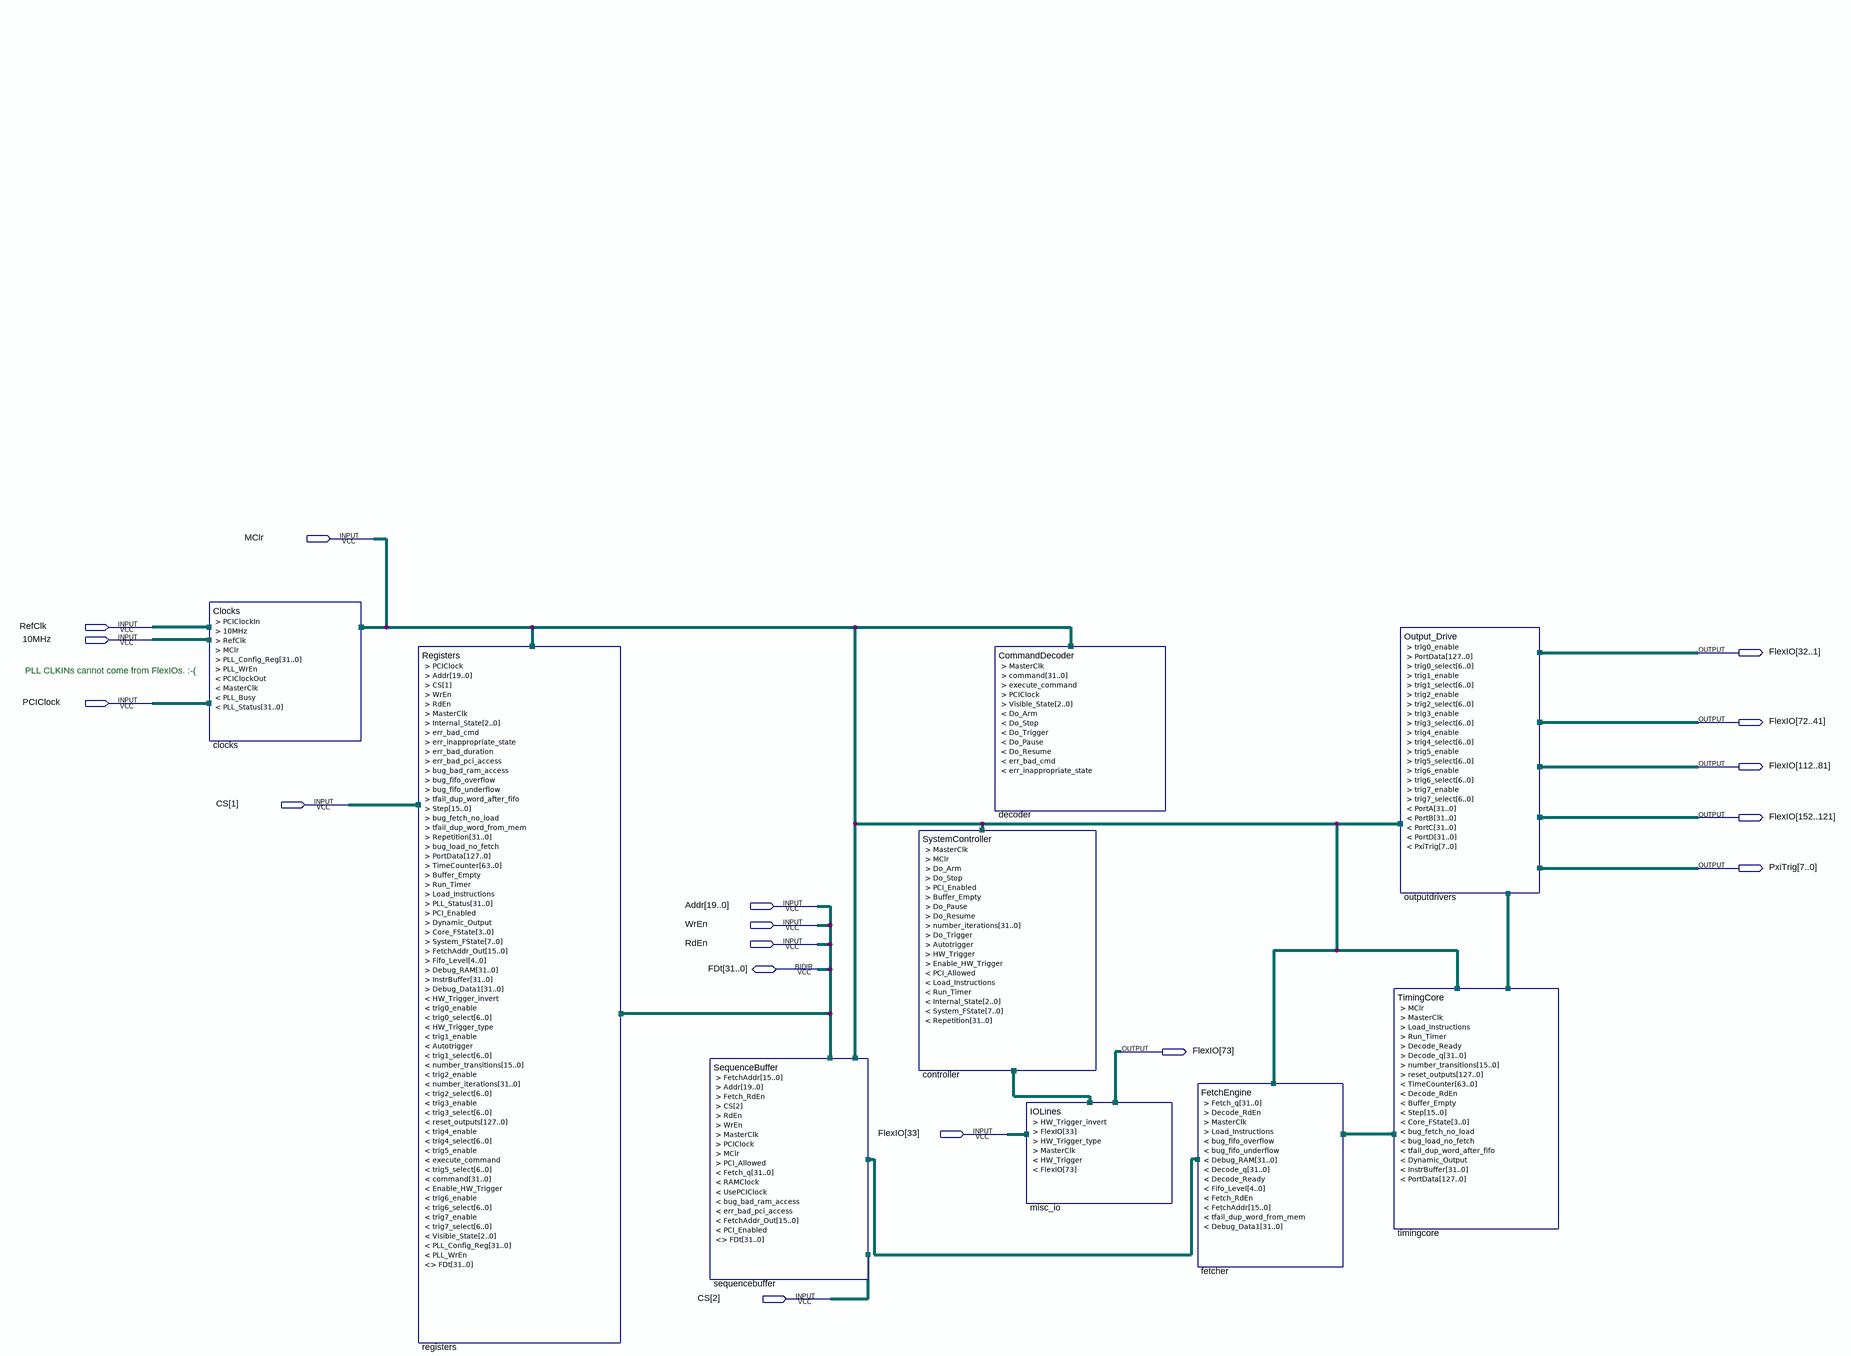
[diagram p0: schematic sheet]
// Quartus schematic TimingGenerator128b.bdf as structural Verilog: 9 symbols, 17 pins
module TimingGenerator128b (
  input  MClr,
  input  RefClk,
  input  \10MHz ,
  input  PCIClock,
  input  [2:1] CS,
  input  [19:0] Addr,
  input  WrEn,
  input  RdEn,
  inout  [152:1] FlexIO,
  inout  [31:0] FDt,
  output [7:0] PxiTrig
);

  wire Autotrigger, Buffer_Empty, bug_bad_ram_access, bug_fetch_no_load, bug_fifo_overflow,
       bug_fifo_underflow, bug_load_no_fetch, Decode_RdEn, Decode_Ready, Do_Arm, Do_Pause, Do_Resume,
       Do_Stop, Do_Trigger, Dynamic_Output, Enable_HW_Trigger, err_bad_pci_access, Fetch_RdEn,
       Load_Instructions, MasterClk, PCI_Allowed, PCI_Enabled, PCIClockBuf, Run_Timer,
       tfail_dup_word_after_fifo, tfail_dup_word_from_mem, trig0_enable, trig1_enable, trig2_enable,
       trig3_enable, trig4_enable, trig5_enable, trig6_enable, trig7_enable;
  wire [2:0] Internal_State;
  wire [3:0] Core_FState;
  wire [4:0] Fifo_Level;
  wire [6:0] trig0_select, trig1_select, trig2_select, trig3_select, trig4_select, trig5_select,
       trig6_select, trig7_select;
  wire [7:0] System_FState;
  wire [15:0] FetchAddr, FetchAddr_Out, number_transitions, Step;
  wire [31:0] Debug_Data1, Debug_RAM, Decode_q, Fetch_q, InstrBuffer, number_iterations, Repetition;
  wire [63:0] TimeCounter;
  wire [127:0] PortData, reset_outputs;

  Clocks clocks (
    .PCIClockIn(PCIClock), .\10MHz (\10MHz ), .RefClk(RefClk), .PCIClockOut(PCIClockBuf));  // open: MClr, PLL_Config_Reg, PLL_WrEn, MasterClk, PLL_Busy, PLL_Status
  Registers registers (
    .PCIClock(PCIClockBuf), .Addr(Addr), .CS(CS[1]), .WrEn(WrEn), .RdEn(RdEn), .MasterClk(MasterClk),
    .err_bad_pci_access(err_bad_pci_access), .bug_bad_ram_access(bug_bad_ram_access),
    .PCI_Enabled(PCI_Enabled), .FetchAddr_Out(FetchAddr_Out), .FDt(FDt));  // open: Internal_State, err_bad_cmd, err_inappropriate_state, err_bad_duration, bug_fifo_overflow, bug_fifo_underflow, tfail_dup_word_after_fifo, Step, bug_fetch_no_load, tfail_dup_word_from_mem, Repetition, bug_load_no_fetch, PortData, TimeCounter, Buffer_Empty, Run_Timer, Load_Instructions, PLL_Status, Dynamic_Output, Core_FState, System_FState, Fifo_Level, Debug_RAM, InstrBuffer, Debug_Data1, HW_Trigger_invert, trig0_enable, trig0_select, HW_Trigger_type, trig1_enable, Autotrigger, trig1_select, number_transitions, trig2_enable, number_iterations, trig2_select, trig3_enable, trig3_select, reset_outputs, trig4_enable, trig4_select, trig5_enable, execute_command, trig5_select, command, Enable_HW_Trigger, trig6_enable, trig6_select, trig7_enable, trig7_select, Visible_State, PLL_Config_Reg, PLL_WrEn
  SequenceBuffer sequencebuffer (
    .FetchAddr(FetchAddr), .Addr(Addr), .Fetch_RdEn(Fetch_RdEn), .CS(CS[2]), .RdEn(RdEn), .WrEn(WrEn),
    .MasterClk(MasterClk), .PCIClock(PCIClockBuf), .Fetch_q(Fetch_q),
    .bug_bad_ram_access(bug_bad_ram_access), .err_bad_pci_access(err_bad_pci_access),
    .FetchAddr_Out(FetchAddr_Out), .PCI_Enabled(PCI_Enabled), .FDt(FDt));  // open: MClr, PCI_Allowed, RAMClock, UsePCIClock
  SystemController controller (
    .MasterClk(MasterClk), .MClr(MClr), .Do_Arm(Do_Arm), .Do_Stop(Do_Stop), .PCI_Enabled(PCI_Enabled),
    .Buffer_Empty(Buffer_Empty), .Do_Pause(Do_Pause), .Do_Resume(Do_Resume),
    .number_iterations(number_iterations), .Do_Trigger(Do_Trigger), .Autotrigger(Autotrigger),
    .Enable_HW_Trigger(Enable_HW_Trigger), .PCI_Allowed(PCI_Allowed), .Load_Instructions(Load_Instructions),
    .Run_Timer(Run_Timer), .Internal_State(Internal_State), .System_FState(System_FState),
    .Repetition(Repetition));  // open: HW_Trigger
  CommandDecoder decoder (.PCIClock(PCIClockBuf));  // open: MasterClk, command, execute_command, Visible_State, Do_Arm, Do_Stop, Do_Trigger, Do_Pause, Do_Resume, err_bad_cmd, err_inappropriate_state
  IOLines misc_io (
    .FlexIO({FlexIO[73], FlexIO[33]}), .MasterClk(MasterClk));  // open: HW_Trigger_invert, HW_Trigger_type, HW_Trigger
  FetchEngine fetcher (
    .Fetch_q(Fetch_q), .Decode_RdEn(Decode_RdEn), .MasterClk(MasterClk),
    .Load_Instructions(Load_Instructions), .bug_fifo_overflow(bug_fifo_overflow),
    .bug_fifo_underflow(bug_fifo_underflow), .Debug_RAM(Debug_RAM), .Decode_q(Decode_q),
    .Decode_Ready(Decode_Ready), .Fifo_Level(Fifo_Level), .Fetch_RdEn(Fetch_RdEn), .FetchAddr(FetchAddr),
    .tfail_dup_word_from_mem(tfail_dup_word_from_mem), .Debug_Data1(Debug_Data1));
  Output_Drive outputdrivers (
    .trig0_enable(trig0_enable), .PortData(PortData), .trig0_select(trig0_select),
    .trig1_enable(trig1_enable), .trig1_select(trig1_select), .trig2_enable(trig2_enable),
    .trig2_select(trig2_select), .trig3_enable(trig3_enable), .trig3_select(trig3_select),
    .trig4_enable(trig4_enable), .trig4_select(trig4_select), .trig5_enable(trig5_enable),
    .trig5_select(trig5_select), .trig6_enable(trig6_enable), .trig6_select(trig6_select),
    .trig7_enable(trig7_enable), .trig7_select(trig7_select), .PortA(FlexIO[32:1]), .PortB(FlexIO[72:41]),
    .PortC(FlexIO[112:81]), .PortD(FlexIO[152:121]), .PxiTrig(PxiTrig));
  TimingCore timingcore (
    .MClr(MClr), .MasterClk(MasterClk), .Load_Instructions(Load_Instructions), .Run_Timer(Run_Timer),
    .Decode_Ready(Decode_Ready), .Decode_q(Decode_q), .number_transitions(number_transitions),
    .reset_outputs(reset_outputs), .TimeCounter(TimeCounter), .Decode_RdEn(Decode_RdEn),
    .Buffer_Empty(Buffer_Empty), .Step(Step), .Core_FState(Core_FState),
    .bug_fetch_no_load(bug_fetch_no_load), .bug_load_no_fetch(bug_load_no_fetch),
    .tfail_dup_word_after_fifo(tfail_dup_word_after_fifo), .Dynamic_Output(Dynamic_Output),
    .InstrBuffer(InstrBuffer), .PortData(PortData));

  // Notes on the sheet:
  //   PLL CLKINs cannot come from FlexIOs. :-(
endmodule
